# EAGLE schematic CapstoneREV_12-16-25_3 (EAGLE 9.5.0)
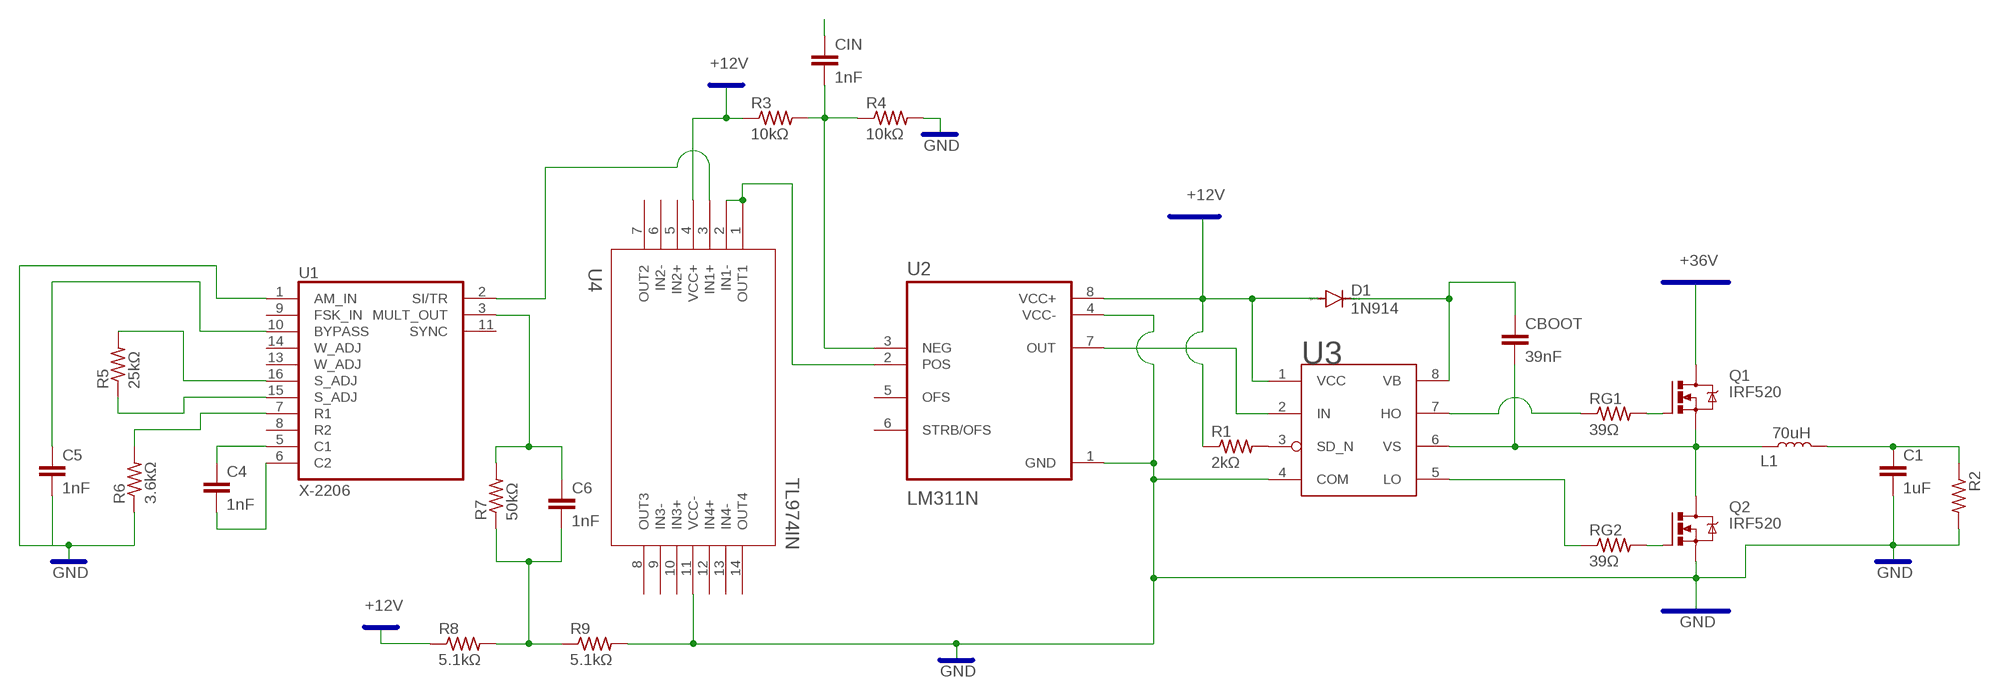
[diagram p0: schematic, sheet 1]

## Parts
C1  1uF  4.7NF-50V-10%(0603)  [0603]
C4  1nF  .1UF-CERCAP-08604  [0402-CAP]
C5  1nF  .1UF-CERCAP-08604  [0402-CAP]
C6  1nF  .1UF-CERCAP-08604  [0402-CAP]
CBOOT  39nF  4.7NF-50V-10%(0603)  [0603]
CIN  1nF  4.7NF-50V-10%(0603)  [0603]
D1  1N914  1N5060GP  [DO15-12]
L1  70uH  1.5UH-2X2-1.4A  [INDUCTOR_2X2]
Q1  IRF520  [TO220BV]
Q2  IRF520  [TO220BV]
R1  2kΩ  R-US_0207/12  [0207/12]
R2  R-US_0207/12  [0207/12]
R3  10kΩ  R-US_0207/12  [0207/12]
R4  10kΩ  R-US_0207/12  [0207/12]
R5  25kΩ  R-US_0207/12  [0207/12]
R6  3.6kΩ  R-US_0207/12  [0207/12]
R7  50kΩ  R-US_0207/12  [0207/12]
R8  5.1kΩ  R-US_0207/12  [0207/12]
R9  5.1kΩ  R-US_0207/12  [0207/12]
RG1  39Ω  R-US_0207/12  [0207/12]
RG2  39Ω  R-US_0207/12  [0207/12]
U1  X-2206  XR-2206  [DIL16]
U2  LM311N  [DIP794W45P254L959H508Q8]
U3  IR2104  [DIP762W46P254L988H533Q8B]
U4  TL974IN  [N14]

## Nets
+12V: D1.A R1.1 R3.1 R8.1 U2.8(VCC+) U3.1(VCC) U4.4(VCC+)
+36V: Q1.D
GND: C1.2 Q2.S R2.2 R4.2 R6.1 R9.2 U1.1(AM_IN) U2.1(GND) U2.4(VCC-) U3.4(COM) U4.11(VCC-)
N$1: U2.7(OUT) U3.2(IN)
N$2: CBOOT.1 D1.C U3.8(VB)
N$3: CBOOT.2 L1.P$1 Q1.S Q2.D U3.6(VS)
N$4: RG1.1 U3.7(HO)
N$5: RG2.1 U3.5(LO)
N$6: R1.2 U3.3(SD_N)
N$7: C6.1 R7.2 U1.3(MULT_OUT)
N$8: C1.1 L1.P$2 R2.1
N$9: C6.2 R7.1 R8.2 R9.1
N$10: U2.2(POS) U4.1(OUT1) U4.2(IN1-)
N$11: CIN.1
N$12: U1.2(SI/TR) U4.3(IN1+)
N$13: C4.1 U1.5(C1)
N$14: C4.2 U1.6(C2)
N$15: Q2.G RG2.2
N$16: R6.2 U1.7(R1)
N$17: R5.2 U1.16(S_ADJ)
N$18: Q1.G RG1.2
N$23: R5.1 U1.15(S_ADJ)
N$27: C5.1 U1.10(BYPASS)
N$28: C5.2
N$31: CIN.2 R3.2 R4.1 U2.3(NEG)
Unconnected: U1.8(R2) U1.9(FSK_IN) U1.11(SYNC) U1.13(W_ADJ) U1.14(W_ADJ) U2.5(OFS) U2.6(STRB/OFS) U4.5(IN2+) U4.6(IN2-) U4.7(OUT2) U4.8(OUT3) U4.9(IN3-) U4.10(IN3+) U4.12(IN4+) U4.13(IN4-) U4.14(OUT4)

## Buses
+10V,+36V
-10V,GND,N$2
GND
+12V

## Power pins joined to a net without a drawn wire
GND: U1.12(GND)
VCC: U1.4(VCC)

## Library data of the parts
C1 CBOOT CIN = SparkFun-Retired:4.7NF-50V-10%(0603): CAP-11378; PROD_ID: CAP-11378; VALUE: 4.7nF
C4-C6 = SparkFun-Retired:.1UF-CER: .1uF ceramic SMT CAP-00810- 25V +80%/-20% (0603) CAP-08390- 100V 10% (0603) CAP-08604- 25V 5% (0603); PROD_ID: CAP-08604; VALUE: 0.1uF
D1 = diode:1N5060GP: DIODE controlled avalanche rectifier
L1 = SparkFun-Coils:1.5UH: FIXED IND 1.5UH 1.4A 120 MOHM; PROD_ID: NDUC-15405; VALUE: 1.5uH
Q1 Q2 = transistor-power:IRF520: HEXFET Power MOSFET
R1-R9 RG1 RG2 = resistor:R-US_: RESISTOR, American symbol
U1 = exar:XR-2206: Monolithic FUNCTION GENERATOR; OC_FARNELL: unknown; OC_NEWARK: unknown
U2 = LM311N:LM311N: Check availability <https://pricing.snapeda.com/parts/LM311N/NOPB/Texas%20Instruments/view-part?ref=eda>; AVAILABILITY: In Stock; CHECK_PRICES: https://www.snapeda.com/parts/LM311N/NOPB/Texas+Instruments/view-part/?ref=eda; DESCRIPTION: Precision, high voltage, floating output comparator; MF: Texas Instruments; MP: LM311N/NOPB; PACKAGE: PDIP-8 Texas; PRICE: None; SNAPEDA_LINK: https://www.snapeda.com/parts/LM311N/NOPB/Texas+Instruments/view-part/?ref=snap
U3 = IR2104:IR2104: IR2104 DIP762W46P254L988H533Q8B Half-Bridge Driver
U4 = TL974IN:TL974IN; COPYRIGHT: Copyright (C) 2025 Ultra Librarian. All rights reserved.; DATASHEET: https://www.ti.com/lit/gpn/tl974; DESCRIPTION: Quad, 12-V, 12-MHz operational amplifier 14-PDIP -40 to 125; MANUFACTURER_NAME: Texas Instruments; MANUFACTURER_PART_NUMBER: TL974IN